# EAGLE design pumpdriver (EAGLE 5.06)
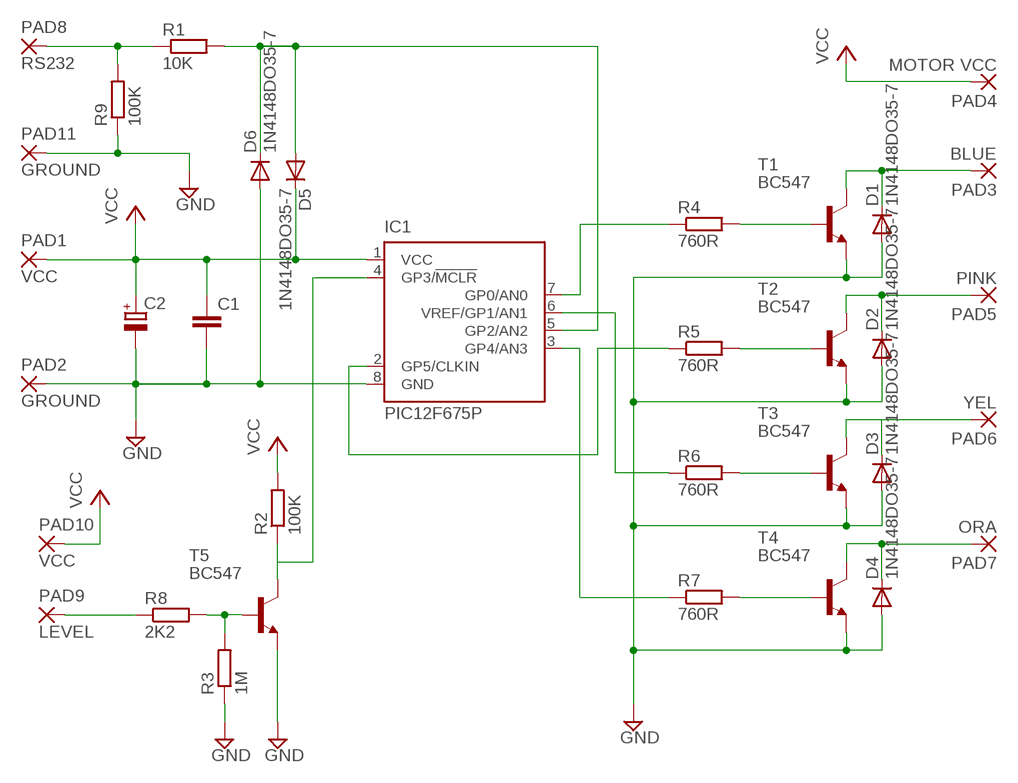
[diagram p0: schematic, sheet 1]

## Parts
C1  C-EU050-025X075  [C050-025X075]
C2  CPOL-EUE5-10.5  [E5-10,5]
D1  1N4148DO35-7  [DO35-7]
D2  1N4148DO35-7  [DO35-7]
D3  1N4148DO35-7  [DO35-7]
D4  1N4148DO35-7  [DO35-7]
D5  1N4148DO35-7  [DO35-7]
D6  1N4148DO35-7  [DO35-7]
IC1  PIC12F675P  [DIL8]
PAD1  VCC  3,81/1,3  [3,81/1,3]
PAD2  GROUND  3,81/1,3  [3,81/1,3]
PAD3  BLUE  3,81/1,3  [3,81/1,3]
PAD4  MOTOR VCC  3,81/1,3  [3,81/1,3]
PAD5  PINK  3,81/1,3  [3,81/1,3]
PAD6  YEL  3,81/1,3  [3,81/1,3]
PAD7  ORA  3,81/1,3  [3,81/1,3]
PAD8  RS232  3,81/1,3  [3,81/1,3]
PAD9  LEVEL  3,81/1,3  [3,81/1,3]
PAD10  VCC  3,81/1,3  [3,81/1,3]
PAD11  GROUND  3,81/1,3  [3,81/1,3]
R1  10K  R-EU_0207/10  [0207/10]
R2  100K  R-EU_0207/10  [0207/10]
R3  1M  R-EU_0207/10  [0207/10]
R4  760R  R-EU_0207/10  [0207/10]
R5  760R  R-EU_0207/10  [0207/10]
R6  760R  R-EU_0207/10  [0207/10]
R7  760R  R-EU_0207/10  [0207/10]
R8  2K2  R-EU_0207/10  [0207/10]
R9  100K  R-EU_0207/10  [0207/10]
T1  BC547  [TO92]
T2  BC547  [TO92]
T3  BC547  [TO92]
T4  BC547  [TO92]
T5  BC547  [TO92]

## Nets
GND: C1.2 C2.- D1.A D2.A D3.A D4.A D6.A IC1.8(GND) PAD2.1(P) PAD11.1(P) R3.1 R9.1 T1.1(E) T2.1(E) T3.1(E) T4.1(E) T5.1(E)
N$1: R3.2 R8.2 T5.2(B)
N$2: IC1.4(GP3/!MCLR) R2.1 T5.3(C)
N$3: PAD8.1(P) R1.1 R9.2
N$4: D5.A D6.C IC1.5(GP2/AN2) R1.2
N$5: D1.C PAD3.1(P) T1.3(C)
N$6: IC1.7(GP0/AN0) R4.1
N$7: IC1.6(VREF/GP1/AN1) R6.1
N$8: IC1.2(GP5/CLKIN) R5.1
N$9: IC1.3(GP4/AN3) R7.1
N$10: D2.C PAD5.1(P) T2.3(C)
N$11: D3.C PAD6.1(P) T3.3(C)
N$12: D4.C PAD7.1(P) T4.3(C)
N$13: R7.2 T4.2(B)
N$14: R6.2 T3.2(B)
N$15: R5.2 T2.2(B)
N$16: R4.2 T1.2(B)
N$17: PAD9.1(P) R8.1
VCC: C1.1 C2.+ D5.C IC1.1(VCC) PAD1.1(P) PAD4.1(P) PAD10.1(P) R2.2

## Library data of the parts
C1 = rcl:C-EU: CAPACITOR, European symbol
C2 = rcl:CPOL-EU: POLARIZED CAPACITOR, European symbol
D1-D6 = diode:1N4148: DIODE high speed (Philips)
IC1 = microchip:PIC12F675: 8-Pin FLASH-Based 8-Bit CMOS Microcontroller Precision Internal 4 MHz oscillator factory calibrated to ±1% Low Power Features: Standby Current: - 1 nA @ 2.0V, typical Operating Current: - 8.5µA @ 32 kHz, 2.0V, typical - 100µA @ 1 MHz, 2.0V, typical Watchdog Timer Current: - 300 nA @ 2.0V, typical Timer1 oscillator current: - 4µA @ 32 kHz, 2.0V, typical Analog-to-Digital Converter module: - 10-bit resolution - Programmable 4-channel input - Voltage reference input Source: http://www.microchip.com .. 41190E.pdf
PAD1-PAD11 = wirepad:3,81/1,3: THROUGH-HOLE PAD
R1-R9 = rcl:R-EU_: RESISTOR, European symbol
T1-T5 = transistor:BC547: NPN TRANSISTOR

## Board
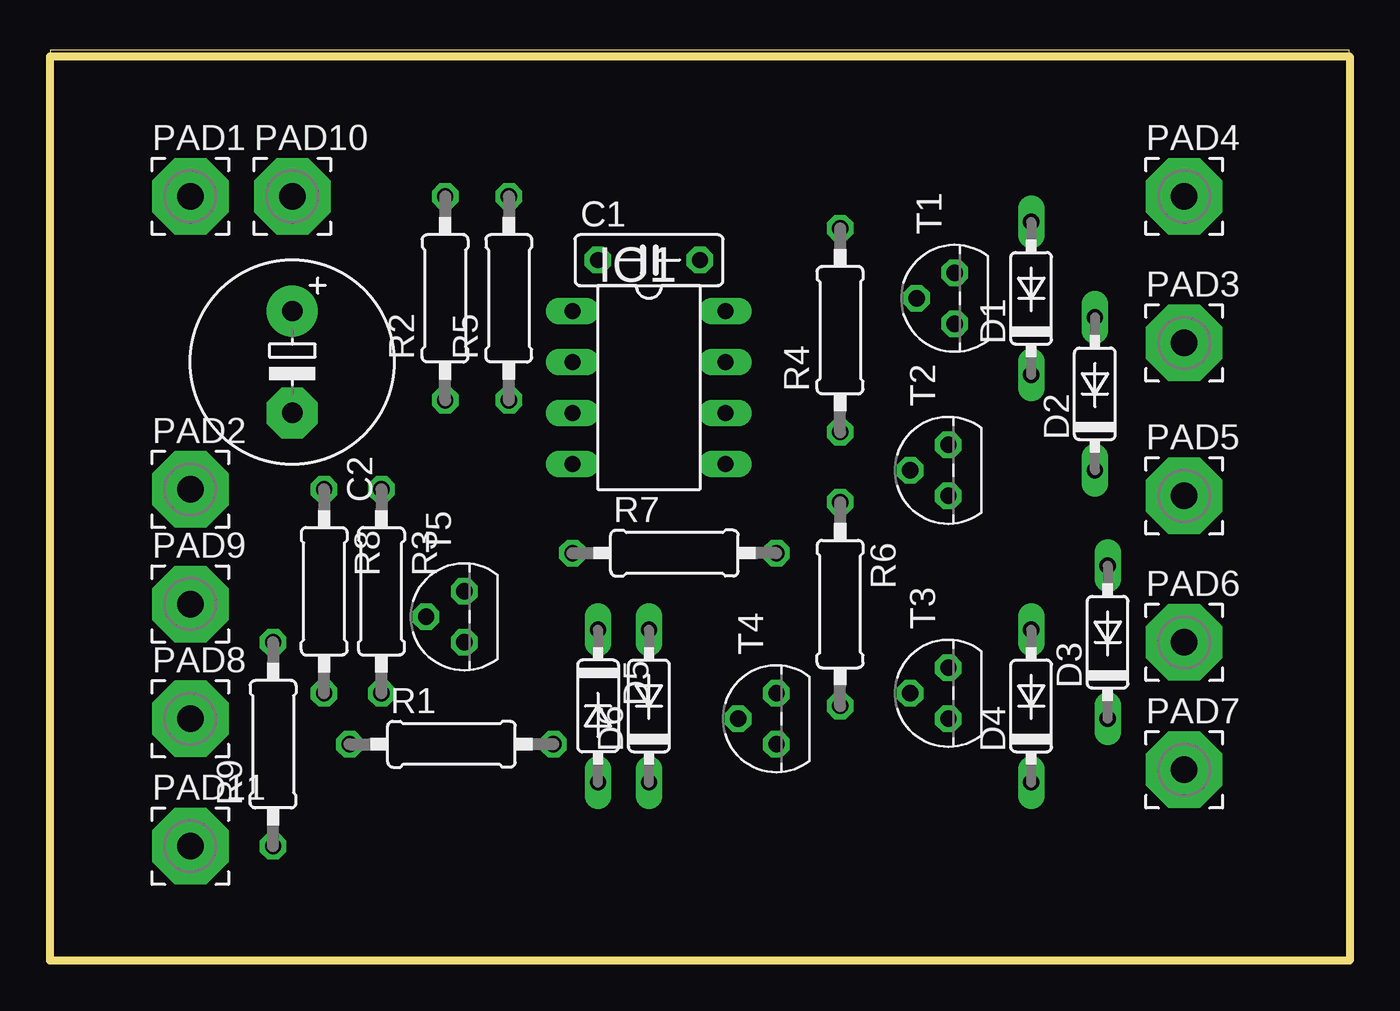
[diagram p1: board, top side]
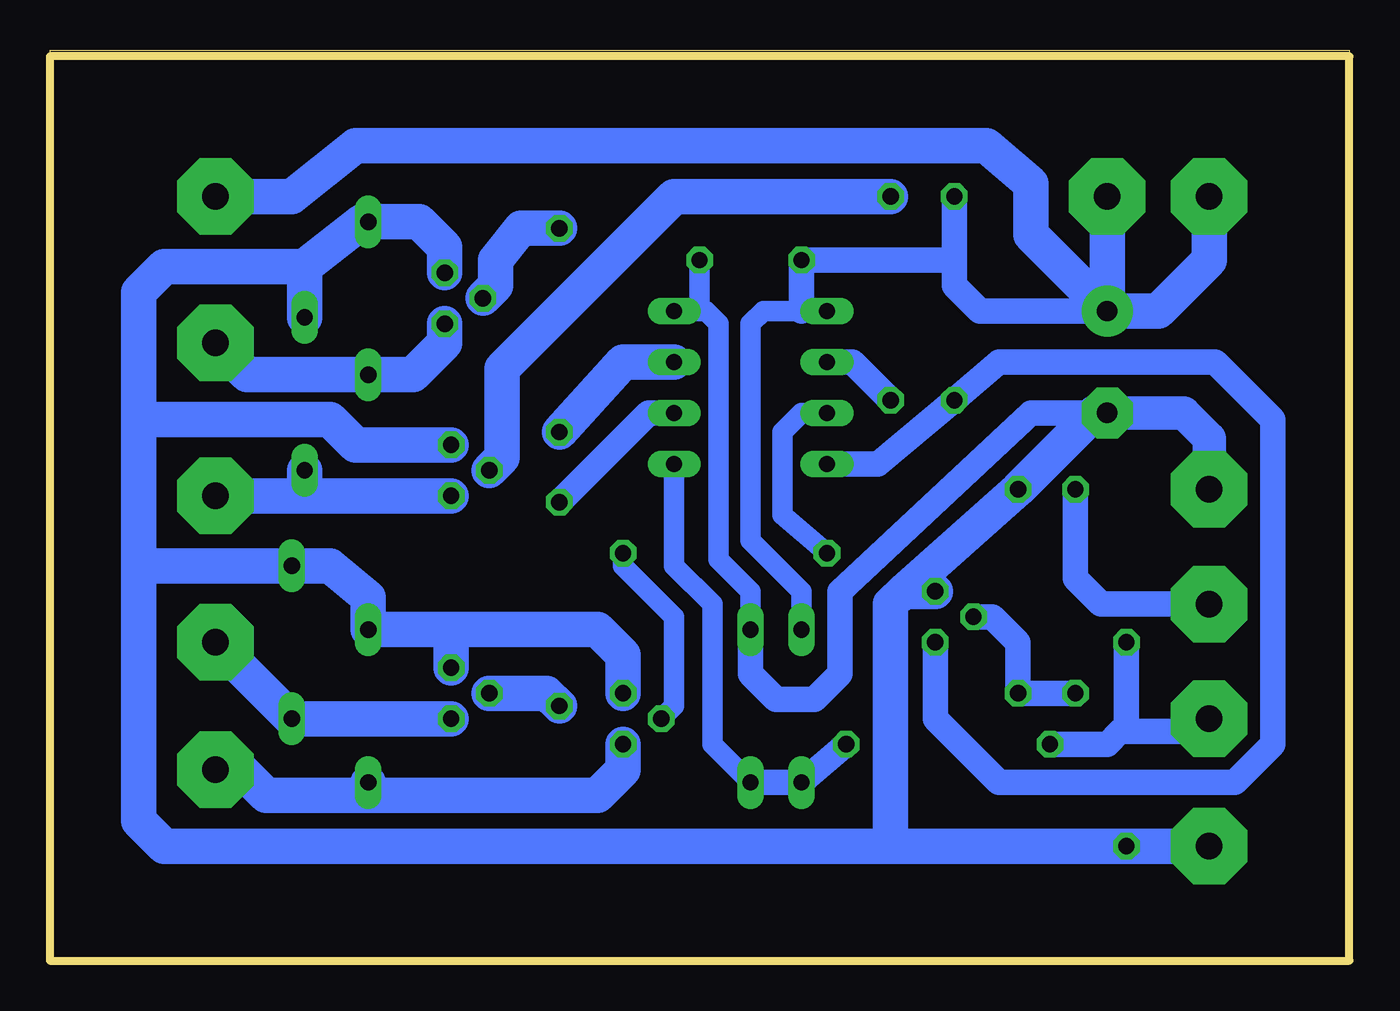
[diagram p2: board, bottom side, seen from below]

Size 64.75 x 45.39 mm. Coordinates in mm from the lower left corner, seen from the top.
Outline: 0,0 64.75,0 64.75,45.39 0,45.39 0,0
Copper layers (1*16): Top 0.035mm / dielectric 1.5mm / Bottom 0.035mm
Design rules "default": minimum track width 10mil, minimum drill 24mil, track to track 8mil, track to pad 8mil, pad to pad 8mil, via to via 8mil, smd to smd 8mil, copper to edge 40mil, drill to drill 8mil, minimum pad ring 10mil, minimum via ring 8mil, stop-mask expansion 4mil, vias tented up to drill 0mil, thermal gap 10mil
Milling: 4 lines

### Footprints (pad centres in the part's own frame; a part is rotated, then mirrored left to right if it is on the bottom)
C050-025X075 = drill 0.813 octagon: 1 -2.54,0; 2 2.54,0
E5-10,5 = drill 1.016 pad 2.54 round: + -2.54,0 | drill 1.016 pad 2.54 octagon: - 2.54,0
DO35-7 = drill 0.813 long: A 3.81,0; C -3.81,0
DIL8 = drill 0.813 long: 1 -3.81,-3.81; 2 -1.27,-3.81; 3 1.27,-3.81; 4 3.81,-3.81; 5 3.81,3.81; 6 1.27,3.81; 7 -1.27,3.81; 8 -3.81,3.81
3,81/1,3 = drill 1.321 pad 3.81 octagon: 1 0,0
0207/10 = drill 0.813 octagon: 1 -5.08,0; 2 5.08,0
TO92 = drill 0.813 octagon: 1 1.27,0; 2 0,1.905; 3 -1.27,0

### Placement (x,y rotation side)
C1  29.84,34.92 0 top
C2  12.06,29.84 270 top
D1  48.9,33.02 90 top
D2  52.07,28.26 90 top
D3  52.7,15.88 90 top
D4  48.9,12.7 90 top
D5  27.3,12.7 270 top
D6  29.84,12.7 90 top
IC1  29.84,28.57 270 top
PAD1  6.99,38.1 0 top
PAD2  6.99,23.5 0 top
PAD3  56.52,30.8 0 top
PAD4  56.52,38.1 0 top
PAD5  56.52,23.18 0 top
PAD6  56.52,15.88 0 top
PAD7  56.52,9.53 0 top
PAD8  6.99,12.06 0 top
PAD9  6.99,17.78 0 top
PAD10  12.06,38.1 0 top
PAD11  6.99,5.71 0 top
R1  20,10.79 0 top
R2  19.68,33.02 90 top
R3  16.51,18.41 270 top
R4  39.37,31.43 90 top
R5  22.86,33.02 90 top
R6  39.37,17.78 270 top
R7  31.11,20.32 0 top
R8  13.65,18.41 270 top
R9  11.11,10.79 90 top
T1  45.09,33.02 90 top
T2  44.77,24.45 90 top
T3  44.77,13.34 90 top
T4  36.2,12.06 90 top
T5  20.64,17.14 90 top

### Tracks (layer width: path | path; a pad name or v marks a point on that pad's centre or on a via)
GND
  Bottom 0.406: PAD11.1 R9.1
  Bottom 1.016: 32.38,32.38 C1.2 | 32.38,32.38 IC1.8 | 32.38,32.38 32.07,32.38 31.43,31.75 31.43,20 29.84,18.41 D6.A 29.84,15.88
  Bottom 1.27: 29.84,15.88 29.84,14.29 28.57,13.02 26.67,13.02 25.4,14.29 25.4,18.41 15.88,27.3 C2.-
  Bottom 1.676: PAD2.1 6.99,26.04 8.26,27.3 C2.-
  Bottom 1.778: 52.07,34.61 49.21,36.83 D1.A 46.35,36.83 45.09,35.56 T1.1 | 52.07,34.61 D2.A | T2.1 49.53,25.72 50.8,26.99 60.33,26.99 | 60.33,26.99 60.33,33.34 59.05,34.61 52.07,34.61 | 60.33,19.68 D3.A 50.8,19.68 48.9,18.1 D4.A 44.77,16.51 | 60.33,19.68 60.33,26.99 | 44.77,16.51 T3.1 | C2.- 12.7,27.3 R3.1 22.23,18.41 | 44.77,16.51 37.47,16.51 36.2,15.24 T4.1 | 22.23,18.41 22.86,17.78 22.86,5.71 | 22.23,18.41 T5.1 | 22.86,5.71 59.05,5.71 60.33,6.99 60.33,19.68 | PAD11.1 R9.1 22.86,5.71
N$1
  Bottom 1.27: T5.2 17.78,17.14 16.51,15.88 R3.2 R8.2
N$2
  Bottom 1.27: T5.3 20.64,12.06 17.46,8.89 5.71,8.89 3.81,10.79 3.81,26.99 6.67,29.84 17.46,29.84 R2.1 23.5,24.77 IC1.4
N$3
  Bottom 1.016: 11.43,11.43 11.11,11.75
  Bottom 1.27: R1.1 12.06,10.79 11.43,11.43 7.62,11.43 PAD8.1 | 11.11,11.75 R9.2
N$4
  Bottom 1.016: IC1.5 33.66,19.68 31.75,17.78 31.75,10.79 D6.C
  Bottom 1.27: R1.2 D5.A D6.C
N$5
  Bottom 1.778: T1.3 45.09,30.8 46.67,29.21 D1.C 54.93,29.21 PAD3.1
N$6
  Bottom 1.778: IC1.7 36.2,29.84 R4.1
N$7
  Bottom 1.27: R6.1 34.92,27.3 IC1.6
N$8
  Bottom 1.27: R5.1 24.77,29.84 IC1.2
N$9
  Bottom 1.016: R7.1 28.26,22.23 28.26,26.35 27.3,27.3 IC1.3
N$10
  Bottom 1.778: T2.3 52.07,23.18 | 52.07,23.18 D2.C | 52.07,23.18 PAD5.1
N$11
  Bottom 1.778: T3.3 D3.C PAD6.1
N$12
  Bottom 1.778: 48.9,8.26 53.98,8.26 55.24,9.53 PAD7.1 | 48.9,8.26 37.47,8.26 36.2,9.53 T4.3 | 48.9,8.26 D4.C
N$13
  Bottom 1.016: T4.2 33.66,12.7 33.66,17.14 36.2,19.68 R7.2
N$14
  Bottom 1.778: R6.2 40.01,13.34 T3.2
N$15
  Bottom 1.778: R5.2 33.66,38.1 42.23,29.53 42.23,25.08 T2.2
N$16
  Bottom 1.778: R4.2 41.27,36.51 42.55,34.92 42.55,33.66 T1.2
N$17
  Bottom 1.27: PAD9.1 12.38,17.78 13.65,19.05 R8.1
VCC
  Bottom 1.016: D5.C 27.3,18.41 29.84,20.95 29.84,31.75 29.21,32.38 27.3,32.38 IC1.1
  Bottom 1.27: C2.+ 18.41,32.38 19.68,33.66 19.68,34.92 | R2.2 19.68,34.92 | 19.68,34.92 C1.1 27.3,32.38
  Bottom 1.778: PAD1.1 6.99,34.92 9.53,32.38 C2.+ | PAD4.1 52.7,38.1 49.53,40.64 18.1,40.64 15.88,38.73 15.88,36.2 C2.+ | C2.+ PAD10.1